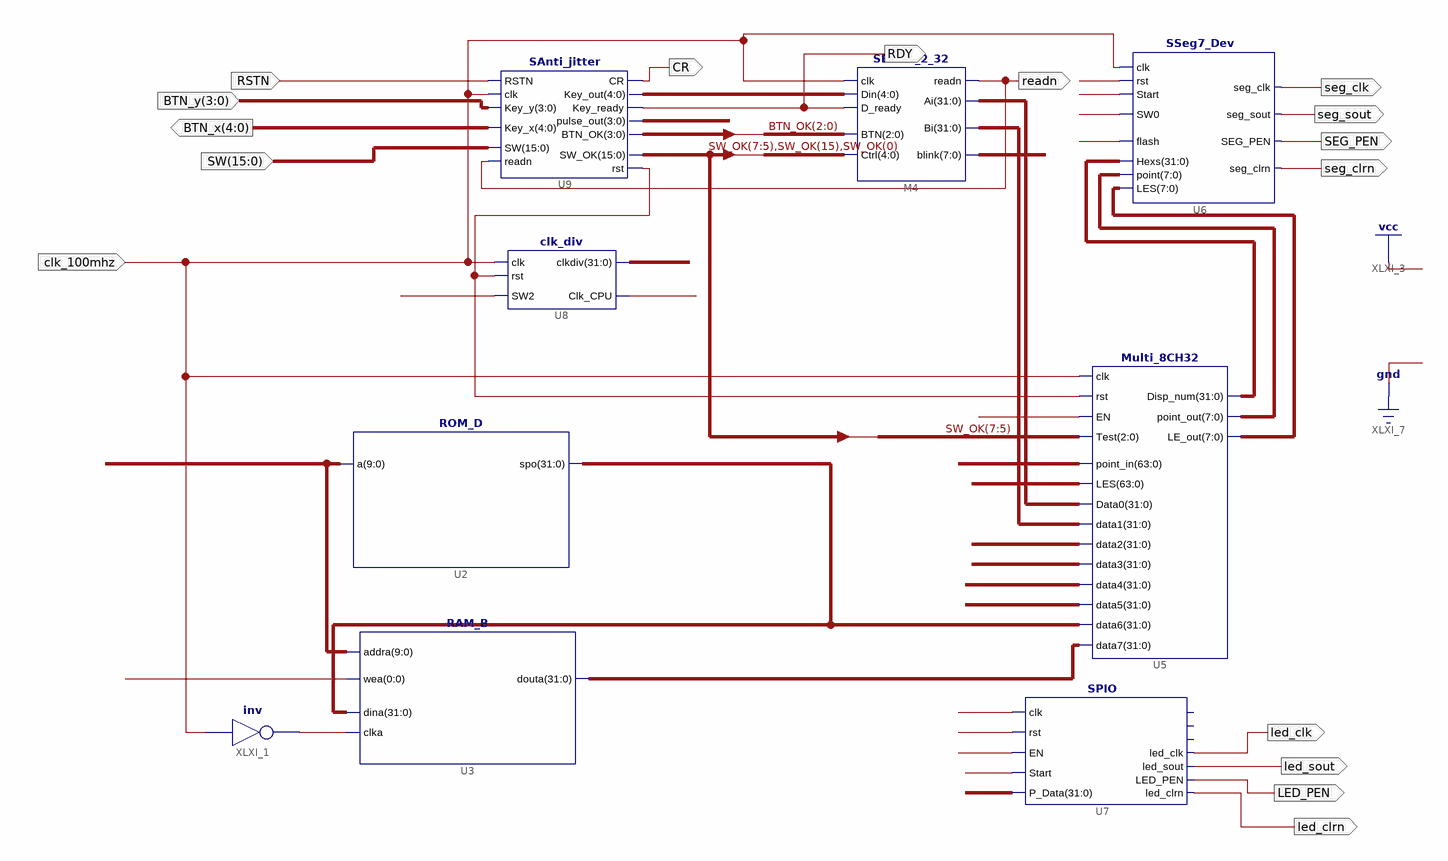
[diagram p0: schematic sheet 1]
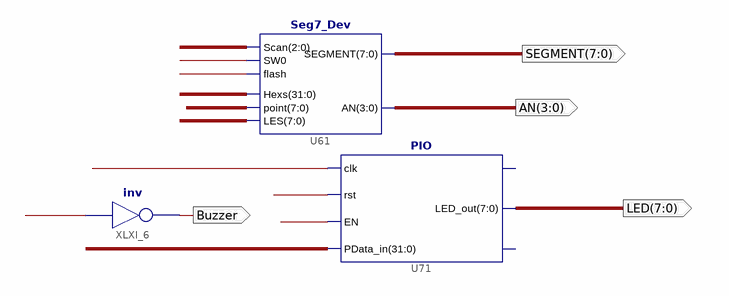
[diagram p1: schematic sheet 2]
// Xilinx ISE schematic lab1_Top.sch (kintex7) as structural Verilog: 12 symbols, 20 ports
module lab1_Top (
  input  RSTN,
  input  [15:0] SW,
  input  [3:0] BTN_y,
  input  clk_100mhz,
  output [4:0] BTN_x,
  output readn,
  output CR,
  output RDY,
  output seg_clk,
  output seg_sout,
  output SEG_PEN,
  output seg_clrn,
  output led_clk,
  output led_sout,
  output led_clrn,
  output LED_PEN,
  output [7:0] SEGMENT,
  output [7:0] LED,
  output [3:0] AN,
  output Buzzer
);

  wire XLXN_10, XLXN_20, XLXN_23, XLXN_33, XLXN_34, XLXN_35, XLXN_36, XLXN_58, XLXN_89, XLXN_90, XLXN_105,
       XLXN_121, XLXN_128, XLXN_138, XLXN_139, XLXN_140, XLXN_141, XLXN_142, XLXN_143;
  wire [0:0] XLXN_17;
  wire [2:0] XLXN_88;
  wire [3:0] BTN_OK, XLXN_31;
  wire [4:0] XLXN_27;
  wire [7:0] XLXN_32, XLXN_55, XLXN_56, XLXN_93, XLXN_94;
  wire [9:0] XLXN_124;
  wire [15:0] SW_OK;
  wire [31:0] XLXN_18, XLXN_37, XLXN_52, XLXN_53, XLXN_54, XLXN_86, XLXN_91, XLXN_122, XLXN_127, XLXN_134,
       XLXN_135, XLXN_136, XLXN_137;
  wire [63:0] XLXN_132, XLXN_133;

  SAnti_jitter U9 (
    .SW(SW), .readn(readn), .Key_y(BTN_y), .Key_x(BTN_x), .RSTN(RSTN), .clk(clk_100mhz), .Key_out(XLXN_27),
    .Key_ready(RDY), .CR(CR), .rst(XLXN_10), .SW_OK(SW_OK), .pulse_out(XLXN_31), .BTN_OK(BTN_OK));
  SEnter_2_32 M4 (
    .readn(readn), .Ai(XLXN_52), .Bi(XLXN_53), .blink(XLXN_32), .Din(XLXN_27), .D_ready(RDY),
    .clk(clk_100mhz), .Ctrl({SW_OK[7:5], SW_OK[15], SW_OK[0]}), .BTN(BTN_OK[2:0]));
  SSeg7_Dev U6 (
    .LES(XLXN_56), .SEG_PEN(SEG_PEN), .seg_sout(seg_sout), .seg_clrn(seg_clrn), .point(XLXN_55),
    .Hexs(XLXN_54), .SW0(XLXN_142), .flash(XLXN_143), .seg_clk(seg_clk), .clk(clk_100mhz), .rst(XLXN_140),
    .Start(XLXN_141));
  Multi_8CH32 U5 (
    .Test(SW_OK[7:5]), .point_in(XLXN_132), .EN(XLXN_58), .clk(clk_100mhz), .rst(XLXN_10), .LES(XLXN_133),
    .Data0(XLXN_52), .data1(XLXN_53), .data2(XLXN_134), .data3(XLXN_135), .data4(XLXN_136), .data5(XLXN_137),
    .data6(XLXN_122), .data7(XLXN_18), .point_out(XLXN_55), .LE_out(XLXN_56), .Disp_num(XLXN_54));
  ROM_D U2 (.a(XLXN_124), .spo(XLXN_122));
  RAM_B U3 (.addra(XLXN_124), .clka(XLXN_20), .wea(XLXN_17[0]), .dina(XLXN_122), .douta(XLXN_18));
  clk_div U8 (.rst(XLXN_10), .clk(clk_100mhz), .SW2(XLXN_23), .clkdiv(XLXN_127), .Clk_CPU(XLXN_128));
  not XLXI_1 (XLXN_20, clk_100mhz);
  SPIO U7 (
    .clk(XLXN_33), .P_Data(XLXN_37), .rst(XLXN_34), .EN(XLXN_35), .Start(XLXN_36), .led_clk(led_clk),
    .led_clrn(led_clrn), .LED_PEN(LED_PEN), .led_sout(led_sout));  // open: GPIOf0, LED_out, counter_set
  Seg7_Dev U61 (
    .LES(XLXN_94), .Scan(XLXN_88), .SEGMENT(SEGMENT), .AN(AN), .point(XLXN_93), .flash(XLXN_90),
    .SW0(XLXN_89), .Hexs(XLXN_91));
  not XLXI_6 (Buzzer, XLXN_105);
  PIO U71 (
    .clk(XLXN_121), .rst(XLXN_138), .EN(XLXN_139), .PData_in(XLXN_86), .LED_out(LED));  // open: GPIOf0, counter_set
endmodule
